# Altium project MMB_Controller.PrjPcb (part 3 of 4)

## Sheet SLO.SchDoc
size B; DrawnBy: PWS; Engineer: PWS; DocumentNumber: 6; Revision: 1; SheetNumber: 6; SheetTotal: 7
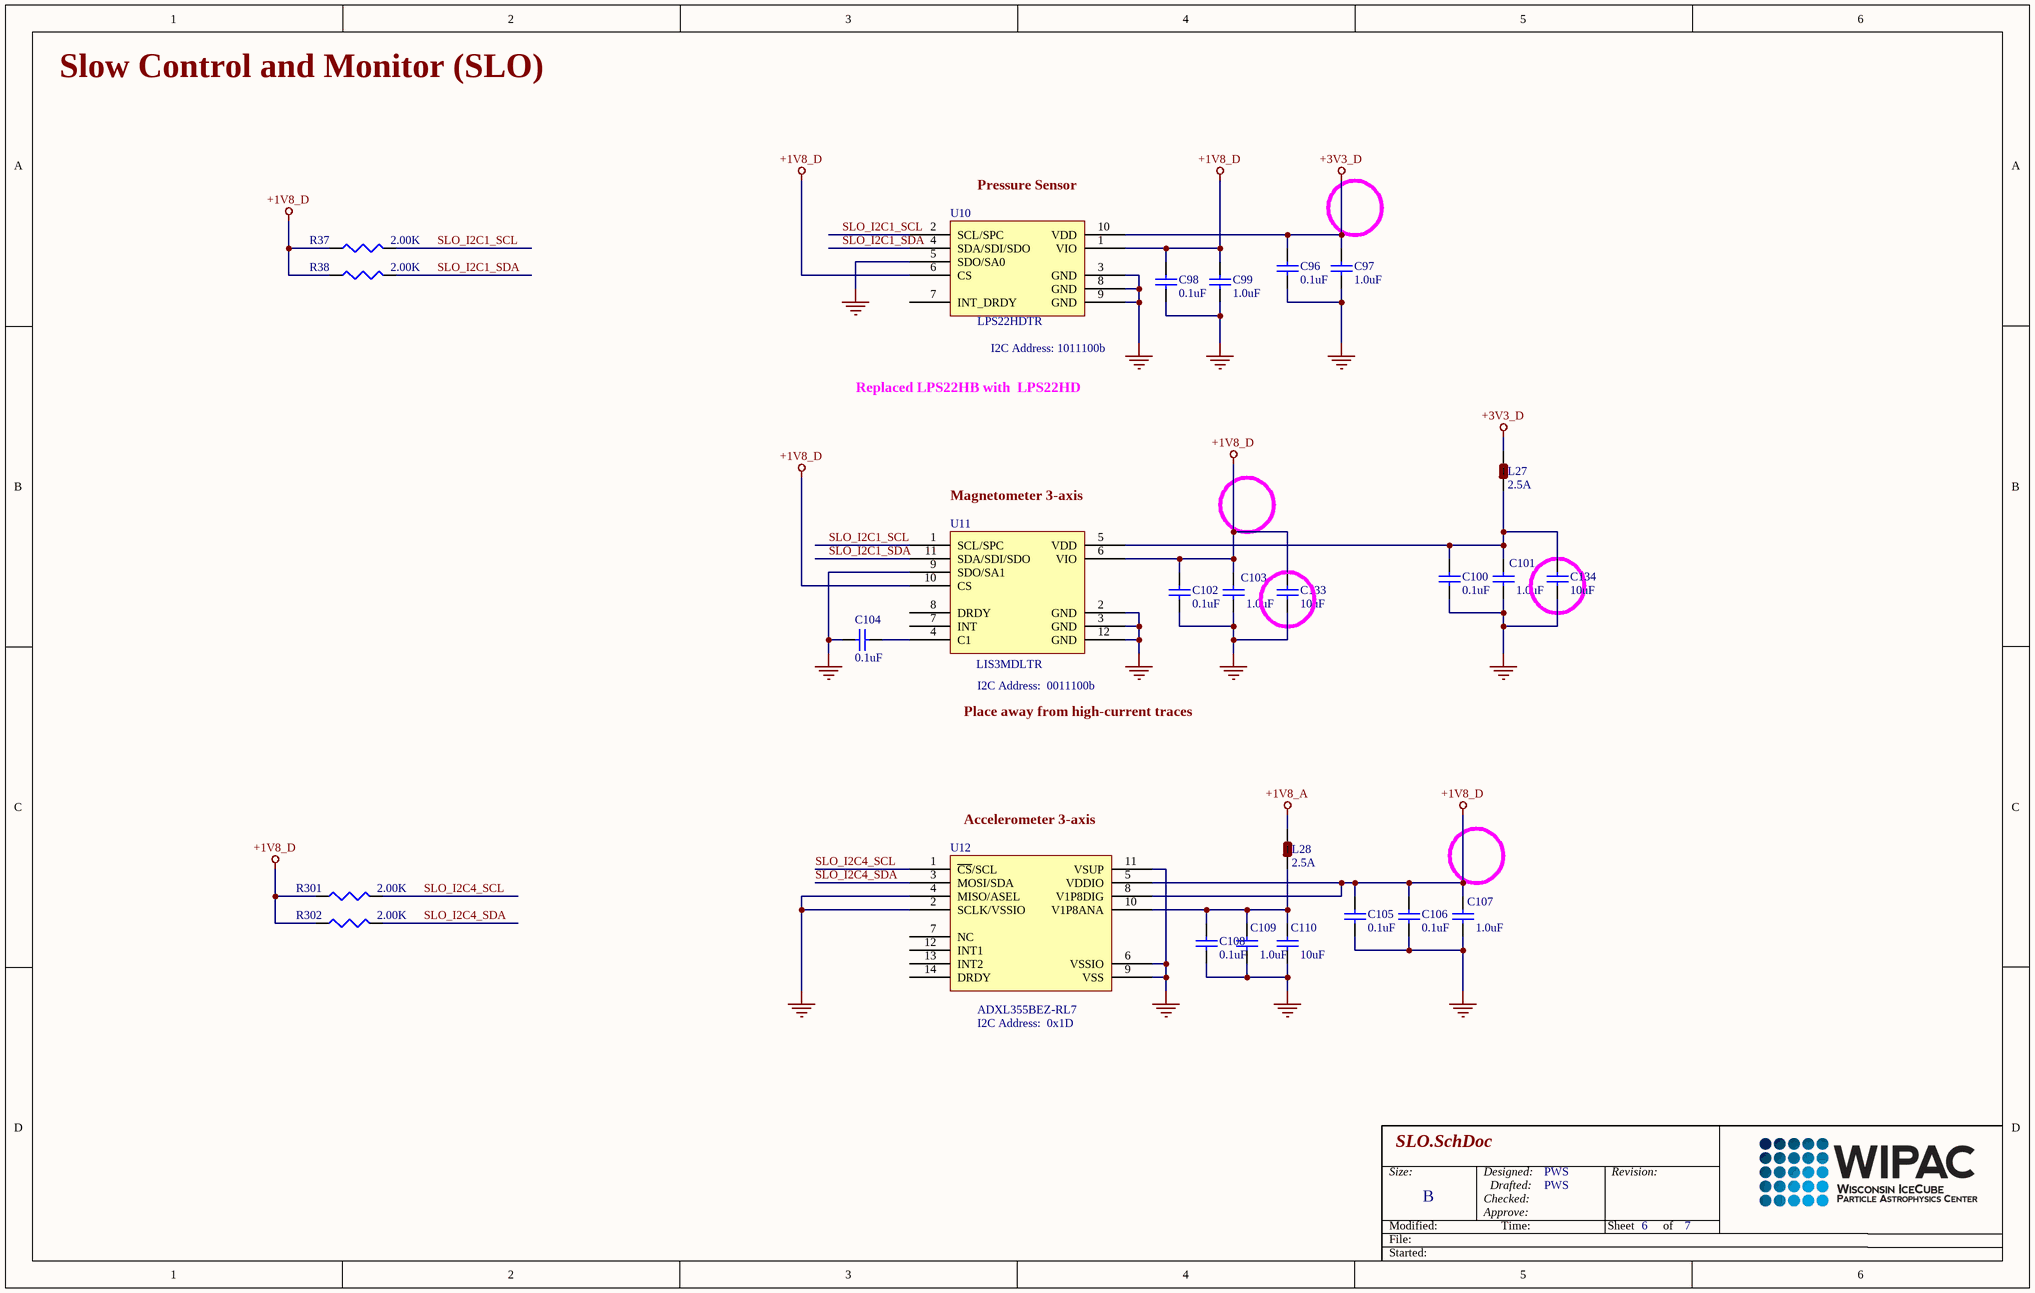
[diagram p3: SLO.SchDoc]

### Parts
C96  Capacitance: 0.1uF  [CAPC_0603]  (hidden comment: 0.1uF_603_50V)
C97  Capacitance: 1.0uF  [CAPC_0603]  (hidden comment: 1.0uF_603_25V)
C98  Capacitance: 0.1uF  [CAPC_0603]  (hidden comment: 0.1uF_603_50V)
C99  Capacitance: 1.0uF  [CAPC_0603]  (hidden comment: 1.0uF_603_25V)
C100  Capacitance: 0.1uF  [CAPC_0603]  (hidden comment: 0.1uF_603_50V)
C101  Capacitance: 1.0uF  [CAPC_0603]  (hidden comment: 1.0uF_603_25V)
C102  Capacitance: 0.1uF  [CAPC_0603]  (hidden comment: 0.1uF_603_50V)
C103  Capacitance: 1.0uF  [CAPC_0603]  (hidden comment: 1.0uF_603_25V)
C104  Capacitance: 0.1uF  [CAPC_0603]  (hidden comment: 0.1uF_603_50V)
C105  Capacitance: 0.1uF  [CAPC_0603]  (hidden comment: 0.1uF_603_50V)
C106  Capacitance: 0.1uF  [CAPC_0603]  (hidden comment: 0.1uF_603_50V)
C107  Capacitance: 1.0uF  [CAPC_0603]  (hidden comment: 1.0uF_603_25V)
C108  Capacitance: 0.1uF  [CAPC_0603]  (hidden comment: 0.1uF_603_50V)
C109  Capacitance: 1.0uF  [CAPC_0603]  (hidden comment: 1.0uF_603_25V)
C110  Capacitance: 10uF  [CAPC_0805]  (hidden comment: 10uF_805_10V)
C133  Capacitance: 10uF  [CAPC_0805]  (hidden comment: 10uF_805_10V)
C134  Capacitance: 10uF  [CAPC_0805]  (hidden comment: 10uF_805_10V)
L27  Max Current Rating: 2.5A  [SMD-0805]  (hidden comment: 2.5A_Bead_0805)
L28  Max Current Rating: 2.5A  [SMD-0805]  (hidden comment: 2.5A_Bead_0805)
R37  Resistance: 2.00K  [RES_0603]  (hidden comment: R_2.00K_603_1%)
R38  Resistance: 2.00K  [RES_0603]  (hidden comment: R_2.00K_603_1%)
R301  Resistance: 2.00K  [RES_0603]  (hidden comment: R_2.00K_603_1%)
R302  Resistance: 2.00K  [RES_0603]  (hidden comment: R_2.00K_603_1%)
U10  LPS22HDTR  [HLGA-10L]
U11  LIS3MDLTR  [VFLGA-12]
U12  ADXL355BEZ-RL7  [E-14-1]

### Nets
+1V8_A: L28.2
+1V8_D: C98.2 C99.2 C102.2 C103.2 C105.2 C106.2 C107.2 C133.2 R37.1 R38.1 R301.1 R302.1 U10.1(VIO) U10.6(CS) U11.6(VIO) U11.10(CS) U12.5(VDDIO) U12.8(V1P8DIG)
+3V3_D: C96.2 C97.2 L27.2 U10.10(VDD)
GND: C96.1 C97.1 C98.1 C99.1 C100.1 C101.1 C102.1 C103.1 C104.2 C105.1 C106.1 C107.1 C108.1 C109.1 C110.1 C133.1 C134.1 U10.3(GND) U10.5(SDO/SA0) U10.8(GND) U10.9(GND) U11.2(GND) U11.3(GND) U11.9(SDO/SA1) U11.12(GND) U12.2(SCLK/VSSIO) U12.4(MISO/ASEL) U12.6(VSSIO) U12.9(VSS) U12.11(VSUP)
SLO_I2C1_SCL: R37.2 U10.2(SCL/SPC) U11.1(SCL/SPC)
SLO_I2C1_SDA: R38.2 U10.4(SDA/SDI/SDO) U11.11(SDA/SDI/SDO)
SLO_I2C4_SCL: R301.2 U12.1(~{CS}/SCL)
SLO_I2C4_SDA: R302.2 U12.3(MOSI/SDA)
NetC100_2: C100.2 C101.2 C134.2 L27.1 U11.5(VDD)
NetC104_1: C104.1 U11.4(C1)
NetC108_2: C108.2 C109.2 C110.2 L28.1 U12.10(V1P8ANA)

Not connected (* = marked no-connect by the designer): U10 7(INT_DRDY); U11 7(INT) 8(DRDY); U12 7(NC) 12(INT1) 13(INT2) 14(DRDY)

### Notes on the sheet
- Slow Control and Monitor (SLO)
- (near U10) Pressure Sensor
- (near U10) I2C Address: 1011100b
- Replaced LPS22HB with  LPS22HD
- (near U11) Magnetometer 3-axis
- (near U11) I2C Address:  0011100b
- Place away from high-current traces
- (near U12) Accelerometer 3-axis
- (near U12) I2C Address:  0x1D
- Size:
- Designed:
- Revision:
- Modified:
- File:
- B
- Checked:
- Approve:
- Drafted:
- Time:
- Sheet
- of
- Started:

### Library data of the parts
C96 C98 C100 C102 C104-C106 C108 = CapC_0.1uF_603_50V: 0.1µF ±10% 50V Ceramic Capacitor X7R 0603 (1608 Metric); Manufacturer: TDK; Manufacturer Part Number: CGJ3E2X7R1H104K080AA; Ratings: COTS; ComponentLink1Description: Datasheet; ComponentLink1URL: https://product.tdk.com/info/en/catalog/datasheets/mlcc_highreliability_general_en.pdf; ComponentLink2Description: Supplier Link; ComponentLink2URL: https://www.digikey.com/products/en?keywords=445-8122-1-ND; Supplier 1: Digi-Key; Stock 1: 697211; Pricing 1: 1 = 0.22000, 10 = 0.15300, 100 = 0.07740, 500 = 0.05294, 1000 = 0.04683 (USD); RoHS: Yes; Mount: Surface Mount; Case/Package: 0603; Weight: 7.1E-05oz; Case Code (Imperial): 0603; Case Code (Metric): 1608; Min Operating Temperature: -55°C; Max Operating Temperature: 125°C; Tolerance: 10%; Voltage Rating: 50V; Voltage Rating (DC): 50V; Packaging: Tape and Reel; Package Quantity: 1; Dielectric: X7R; Termination: SMD/SMT; Composition: Ceramic; Length: 1.6mm; Height: 0.8mm; Width: 0.8mm; Thickness: 0.035inch; Depth: 0.8mm; Radiation Hardening: No; Lead Free: Lead Free; Supplier Part Number 1: 445-8122-1-ND
C97 C99 C101 C103 C107 C109 = CapC_1.0uF_603_25V: 1µF ±10% 25V Ceramic Capacitor X7R 0603 (1608 Metric); Manufacturer: Murata; Manufacturer Part Number: GCJ188R71E105KA01D; Supplier 1: Digi-Key; Supplier Part Number 1: 490-14409-1-ND; RoHS: No; ComponentLink1URL: https://www.digikey.com/products/en?keywords=490-14409-1-ND; ComponentLink1Description: Supplier Link; Stock 1: 166271; Pricing 1: 1=0.28000, 10=0.19400, 100=0.11020, 500=0.07780, 1000=0.06807 (USD); Case/Package: 0603; Lead Free: Lead Free; ComponentLink2Description: Datasheet; ComponentLink2URL: https://search.murata.co.jp/Ceramy/image/img/A01X/G101/ENG/GCJ188R71E105KA01-01.pdf; ComponentLink3Description: Catalog; ComponentLink3URL: https://www.murata.com/~/media/webrenewal/support/library/catalog/products/capacitor/mlcc/c03e.ashx?la=en-us
C110 C133 C134 = CapC_10uF_805_10V: Capacitor; Manufacturer: Murata; Manufacturer Part Number: GCJ21BR71A106KE01L; Tolerance: 10%; Dielectric: X7R; Voltage Rating: 10V; ComponentLink1URL: https://www.murata.com/~/media/webrenewal/support/library/catalog/products/capacitor/mlcc/c03e.ashx?la=en-us; ComponentLink1Description: Datasheet; Supplier 1: Digi-Key; Stock 1: 140399; Pricing 1: 1 = 0.70000, 10 = 0.49300, 100 = 0.32440, 500 = 0.24032, 1000 = 0.20428 (USD); RoHS: Yes; ComponentLink2URL: https://www.digikey.com/products/en?keywords=490-12646-1-ND; ComponentLink2Description: Supplier Link; Supplier Part Number 1: 490-12646-1-ND; Mount: Surface Mount; Case/Package: 0805; Weight: 0.000335oz; Case Code (Metric): 2012; Case Code (Imperial): 0805; Min Operating Temperature: -55°C; Max Operating Temperature: 125°C; Packaging: Tape and Reel; Termination: SMD/SMT; Voltage Rating (DC): 10V; Package Quantity: 3000; Features: Soft Termination; Length: 2mm; Height: 1.25mm; Width: 0.049inch; Thickness: 0.057inch; Depth: 1.25mm; Ratings: AEC-Q200
L27 L28 = Bead SM_805_2.5A_TDK: MPZ2012S331ATD25; Manufacturer: TDK; DC Resistance (DCR): 50mR; Number of Lines: 1; Impedance: 330R; Tolerance: 25%; Test Frequency: 100MHz; Supplier 1: Digi-Key; Manufacturer Part Number: MPZ2012S331ATD25; RoHS: Yes; Stock 1: 19319; Pricing 1: 1=0.13000, 10=0.10400, 25=0.08080, 50=0.06700, 100=0.05780, 250=0.04620, 500=0.04158, 1000=0.03465 (USD); Packaging: Tape and Reel; ComponentLink1URL: https://product.tdk.com/info/en/catalog/datasheets/beads_automotive_power_mpz2012_en.pdf; ComponentLink1Description: Datasheet; Supplier Part Number 1: 445-172907-1-ND; Mount: Surface Mount; Case/Package: 0805; Weight: 0.000194oz; Case Code (Metric): 2012; Case Code (Imperial): 0805; Min Operating Temperature: -55°C; Max Operating Temperature: 125°C; Package Quantity: 4000; Termination: SMD/SMT; Max DC Current: 2.5A; Length: 0.079inch; Height: 0.041inch; Width: 0.049inch; Ratings: AEC-Q200; Lead Free: Lead Free
R37 R38 R301 R302 = R_2.00K_603_1%: RES 2.00K OHM 1/10W 1% 0603 SMD; Manufacturer: Panasonic; Manufacturer Part Number: ERJ3EKF2001V; Temperature Coefficient: 100ppm/°C; Max Power Dissipation: 100mW; Voltage Rating: 75V; Voltage Rating (DC): 50V; Supplier 1: Digi-Key; RoHS: Yes; Stock 1: 3931284; Pricing 1: 1 = 0.10000, 10 = 0.06500, 100 = 0.02640, 1000 = 0.01186, 2500 = 0.01029 (USD); Packaging: Tape and Reel; Tolerance: 1%; Composition: Thick Film; Features: Automotive AEC-Q200; Height: 0.022inch; Number of Terminations: 2; ComponentLink1URL: https://datasheet.ciiva.com/16200/aoa0000ce2-16200501.pdf?src-supplier=Future+Electronics; ComponentLink1Description: https://datasheet.ciiva.com/16200/aoa0000ce2-16200501.pdf?src-supplier=Future+Electronics; Supplier Part Number 1: P2.00KHCT-ND; Mount: Surface Mount; Case/Package: 0603; Contact Plating: Tin; Case Code (Metric): 1608; Case Code (Imperial): 0603; Min Operating Temperature: -55°C; Max Operating Temperature: 155°C; Package Quantity: 1; Power Rating: 100mW; Military Standard: Not; Termination: SMD/SMT; Length: 1.6mm; Width: 0.031inch; Depth: 0.8mm; Radiation Hardening: No; REACH SVHC: No SVHC; Lead Free: Lead Free; ComponentLink2URL: https://datasheet.ciiva.com/43460/1678782-43460485.pdf?src-supplier=Farnell; ComponentLink2Description: https://datasheet.ciiva.com/43460/1678782-43460485.pdf?src-supplier=Farnell; ComponentLink3URL: https://datasheet.ciiva.com/28673/1678782-28673990.pdf?src-supplier=Element14; ComponentLink3Description: https://datasheet.ciiva.com/28673/1678782-28673990.pdf?src-supplier=Element14; ComponentLink4URL: https://datasheet.ciiva.com/46377/1678782-46377366.pdf?src-supplier=Element14; ComponentLink4Description: https://datasheet.ciiva.com/46377/1678782-46377366.pdf?src-supplier=Element14; ComponentLink5URL: https://datasheet.ciiva.com/30064/aoa0000ce2-30064920.pdf?src-supplier=Onlinecomponents.com; ComponentLink5Description: https://datasheet.ciiva.com/30064/aoa0000ce2-30064920.pdf?src-supplier=Onlinecomponents.com; ComponentLink6URL: https://datasheet.ciiva.com/16771/70260748-16771369.pdf?src-supplier=Allied+Electronics; ComponentLink6Description: https://datasheet.ciiva.com/16771/70260748-16771369.pdf?src-supplier=Allied+Electronics; ComponentLink7URL: https://datasheet.ciiva.com/17214/aoa0000ce2-17214393.pdf?src-supplier=Avnet+Europe; ComponentLink7Description: https://datasheet.ciiva.com/17214/aoa0000ce2-17214393.pdf?src-supplier=Avnet+Europe; ComponentLink8URL: https://datasheet.ciiva.com/6082/1678782-6082059.pdf?src-supplier=Farnell; ComponentLink8Description: https://datasheet.ciiva.com/6082/1678782-6082059.pdf?src-supplier=Farnell; ComponentLink9URL: https://datasheet.ciiva.com/24027/aoa0000ce2-24027453.pdf?src-supplier=Mouser; ComponentLink9Description: https://datasheet.ciiva.com/24027/aoa0000ce2-24027453.pdf?src-supplier=Mouser
U10 = LPS22HDTR: Pressure Sensor  Absolute   10-VFLGA; Manufacturer: STMicroelectronics; Supplier 1: Digi-Key; Manufacturer Part Number: LPS22HDTR; Stock 1: 178; Pricing 1: 1 = 4.23000, 10 = 3.79600, 25 = 3.58880, 100 = 3.11030, 500 = 2.64770, 1000 = 2.23300 (USD); RoHS: No; ComponentLink2URL: https://www.digikey.com/products/en?keywords=497-17587-1-ND; ComponentLink2Description: Supplier Link; Supplier Part Number 1: 497-17587-1-ND; ComponentLink1Description: Datasheet; ComponentLink1URL: https://www.st.com/content/ccc/resource/technical/document/datasheet/group3/8a/d9/56/bc/42/4c/42/ae/DM00342209/files/DM00342209.pdf/jcr:content/translations/en.DM00342209.pdf; ComponentLink3URL: http://www.st.com/content/ccc/resource/technical/document/datasheet/group3/8a/d9/56/bc/42/4c/42/ae/DM00342209/files/DM00342209.pdf/jcr:content/translations/en.DM00342209.pdf?src-supplier=Digi-Key; ComponentLink3Description: http://www.st.com/content/ccc/resource/technical/document/datasheet/group3/8a/d9/56/bc/42/4c/42/ae/DM00342209/files/DM00342209.pdf/jcr:content/translations/en.DM00342209.pdf?src-supplier=Digi-Key
U11 = LIS3MDLTR: Magnetoresistive Sensor X, Y, Z Axis 12-LGA (2x2); Manufacturer: STMicroelectronics; Max Supply Voltage: 3.6V; Min Supply Voltage: 1.9V; Max Supply Current: 270uA; Resolution: 16b; Output Type: SPI; Axis: X, Y, Z; ComponentLink1Description: Datasheet; ComponentLink1URL: https://www.st.com/content/ccc/resource/technical/document/datasheet/54/2a/85/76/e3/97/42/18/DM00075867.pdf/files/DM00075867.pdf/jcr:content/translations/en.DM00075867.pdf; Supplier 1: Digi-Key; Manufacturer Part Number: LIS3MDLTR; Stock 1: 20171; Pricing 1: 1 = 1.67000, 10 = 1.49800, 100 = 1.20450, 500 = 0.98958, 1000 = 0.81993 (USD); RoHS: Yes; Mount: Surface Mount; Case/Package: LGA; Number of Pins: 12; Contact Plating: Gold; Min Operating Temperature: -40°C; Max Operating Temperature: 85°C; Packaging: Tape and Reel; Package Quantity: 8000; Sensing Method: Magnetoresistive; Radiation Hardening: No; REACH SVHC: No SVHC; Lead Free: Lead Free; Supplier Part Number 1: 497-13892-1-ND; ComponentLink2Description: Footprint data; ComponentLink2URL: http://mydiscuz.b0.upaiyun.com/forum/201602/17/145811me52roaer17ott71.attach?_upd=LSM303AGR_Footprint.pdf
U12 = ADXL355BEZ-RL7: Accelerometer X, Y, Z Axis ±2g, 4g, 8g 1.5kHz 14-CLCC (6x6); Manufacturer: Analog Devices; ComponentLink1Description: Datasheet; ComponentLink1URL: https://www.analog.com/media/en/technical-documentation/data-sheets/ADXL354_355.pdf; Supplier 1: Digi-Key; Manufacturer Part Number: ADXL355BEZ-RL7; Stock 1: 1191; Pricing 1: 1 = 53.40000, 10 = 50.16300, 100 = 44.98520 (USD); RoHS: No; Number of Pins: 14; Lead Free: Contains Lead; ComponentLink2URL: https://www.analog.com/media/en/technical-documentation/data-sheets/ADXL354_355.pdf?src-supplier=Digi-Key; ComponentLink2Description: https://www.analog.com/media/en/technical-documentation/data-sheets/ADXL354_355.pdf?src-supplier=Digi-Key; Supplier Part Number 1: ADXL355BEZ-RL7CT-ND

## Sheet XTIO.SchDoc
size B; DrawnBy: PWS; Engineer: PWS; Organization: WIPAC; Revision: 2.0; SheetNumber: 7; SheetTotal: 7; DocumentNumber: 7
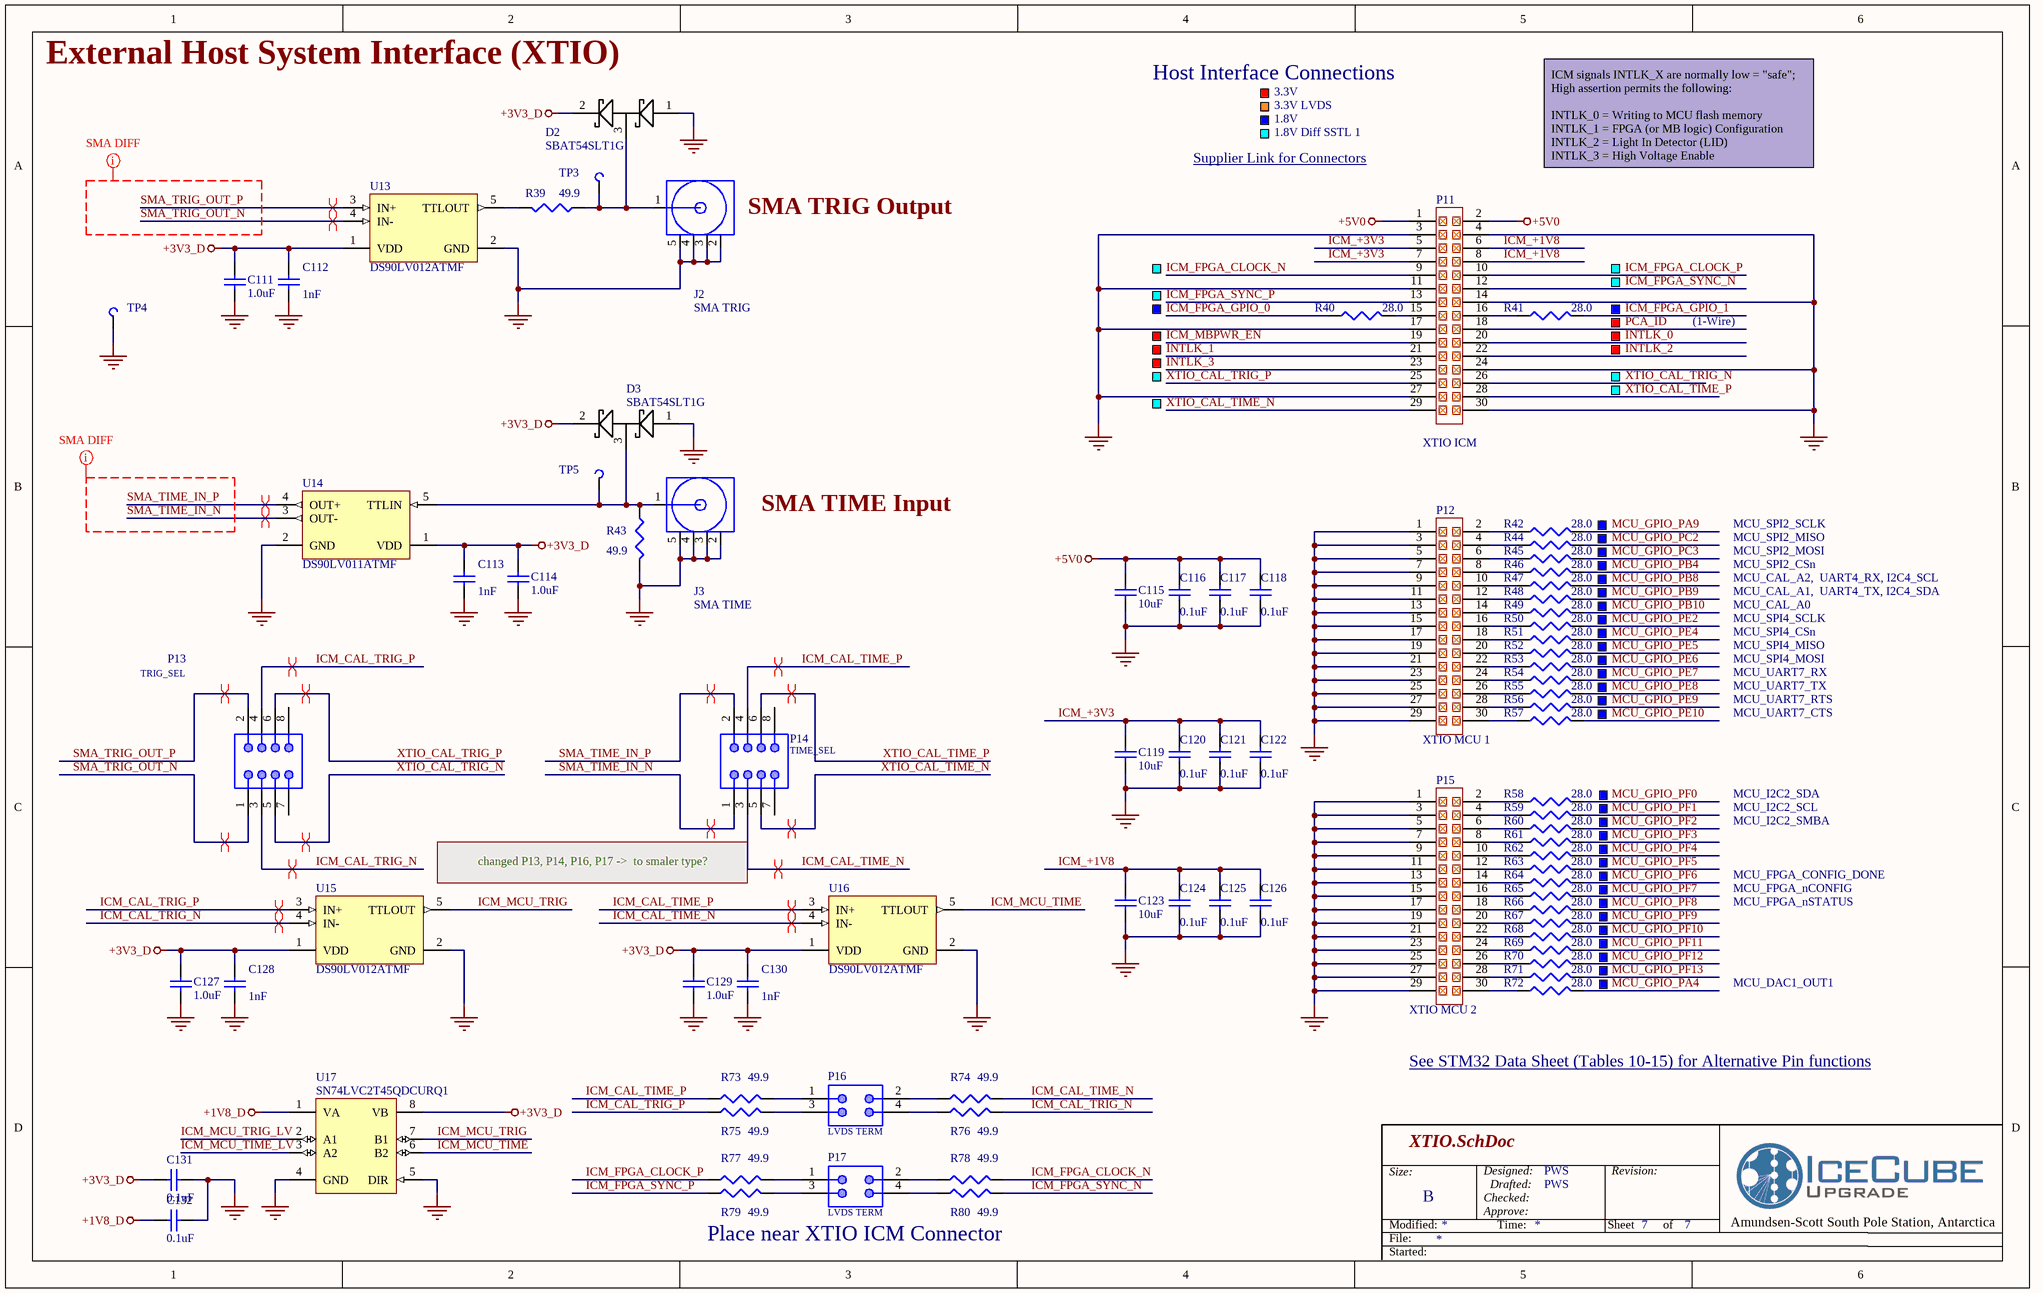
[diagram p4: XTIO.SchDoc]

### Parts
C111  Capacitance: 1.0uF  [CAPC_0603]  (hidden comment: 1.0uF_603_25V)
C112  Capacitance: 1nF  [CAPC_0603]  (hidden comment: 1000pF_603_50V)
C113  Capacitance: 1nF  [CAPC_0603]  (hidden comment: 1000pF_603_50V)
C114  Capacitance: 1.0uF  [CAPC_0603]  (hidden comment: 1.0uF_603_25V)
C115  Capacitance: 10uF  [CAPC_0805]  (hidden comment: 10uF_805_10V)
C116  Capacitance: 0.1uF  [CAPC_0603]  (hidden comment: 0.1uF_603_50V)
C117  Capacitance: 0.1uF  [CAPC_0603]  (hidden comment: 0.1uF_603_50V)
C118  Capacitance: 0.1uF  [CAPC_0603]  (hidden comment: 0.1uF_603_50V)
C119  Capacitance: 10uF  [CAPC_0805]  (hidden comment: 10uF_805_10V)
C120  Capacitance: 0.1uF  [CAPC_0603]  (hidden comment: 0.1uF_603_50V)
C121  Capacitance: 0.1uF  [CAPC_0603]  (hidden comment: 0.1uF_603_50V)
C122  Capacitance: 0.1uF  [CAPC_0603]  (hidden comment: 0.1uF_603_50V)
C123  Capacitance: 10uF  [CAPC_0805]  (hidden comment: 10uF_805_10V)
C124  Capacitance: 0.1uF  [CAPC_0603]  (hidden comment: 0.1uF_603_50V)
C125  Capacitance: 0.1uF  [CAPC_0603]  (hidden comment: 0.1uF_603_50V)
C126  Capacitance: 0.1uF  [CAPC_0603]  (hidden comment: 0.1uF_603_50V)
C127  Capacitance: 1.0uF  [CAPC_0603]  (hidden comment: 1.0uF_603_25V)
C128  Capacitance: 1nF  [CAPC_0603]  (hidden comment: 1000pF_603_50V)
C129  Capacitance: 1.0uF  [CAPC_0603]  (hidden comment: 1.0uF_603_25V)
C130  Capacitance: 1nF  [CAPC_0603]  (hidden comment: 1000pF_603_50V)
C131  Capacitance: 0.1uF  [CAPC_0603]  (hidden comment: 0.1uF_603_50V)
C132  Capacitance: 0.1uF  [CAPC_0603]  (hidden comment: 0.1uF_603_50V)
D2  SBAT54SLT1G  [SOT-23]
D3  SBAT54SLT1G  [SOT-23]
J2  SMA TRIG  [SMA Vertical 200LS]
J3  SMA TIME  [SMA Vertical 200LS]
P11  XTIO ICM  [45230-220230]
P12  XTIO MCU 1  [45230-220230]
P13  TRIG_SEL  [62100821021]
P14  TIME_SEL  [62100821021]
P15  XTIO MCU 2  [45230-220230]
P16  LVDS TERM  [62100421021]
P17  LVDS TERM  [62100421021]
R39  Resistance: 49.9  [RES_1206]  (hidden comment: R_49.9_1206_1%)
R40  Resistance: 28.0  [RES_0603]  (hidden comment: R_28.0_603_1%)
R41  Resistance: 28.0  [RES_0603]  (hidden comment: R_28.0_603_1%)
R42  Resistance: 28.0  [RES_0603]  (hidden comment: R_28.0_603_1%)
R43  Resistance: 49.9  [RES_1206]  (hidden comment: R_49.9_1206_1%)
R44  Resistance: 28.0  [RES_0603]  (hidden comment: R_28.0_603_1%)
R45  Resistance: 28.0  [RES_0603]  (hidden comment: R_28.0_603_1%)
R46  Resistance: 28.0  [RES_0603]  (hidden comment: R_28.0_603_1%)
R47  Resistance: 28.0  [RES_0603]  (hidden comment: R_28.0_603_1%)
R48  Resistance: 28.0  [RES_0603]  (hidden comment: R_28.0_603_1%)
R49  Resistance: 28.0  [RES_0603]  (hidden comment: R_28.0_603_1%)
R50  Resistance: 28.0  [RES_0603]  (hidden comment: R_28.0_603_1%)
R51  Resistance: 28.0  [RES_0603]  (hidden comment: R_28.0_603_1%)
R52  Resistance: 28.0  [RES_0603]  (hidden comment: R_28.0_603_1%)
R53  Resistance: 28.0  [RES_0603]  (hidden comment: R_28.0_603_1%)
R54  Resistance: 28.0  [RES_0603]  (hidden comment: R_28.0_603_1%)
R55  Resistance: 28.0  [RES_0603]  (hidden comment: R_28.0_603_1%)
R56  Resistance: 28.0  [RES_0603]  (hidden comment: R_28.0_603_1%)
R57  Resistance: 28.0  [RES_0603]  (hidden comment: R_28.0_603_1%)
R58  Resistance: 28.0  [RES_0603]  (hidden comment: R_28.0_603_1%)
R59  Resistance: 28.0  [RES_0603]  (hidden comment: R_28.0_603_1%)
R60  Resistance: 28.0  [RES_0603]  (hidden comment: R_28.0_603_1%)
R61  Resistance: 28.0  [RES_0603]  (hidden comment: R_28.0_603_1%)
R62  Resistance: 28.0  [RES_0603]  (hidden comment: R_28.0_603_1%)
R63  Resistance: 28.0  [RES_0603]  (hidden comment: R_28.0_603_1%)
R64  Resistance: 28.0  [RES_0603]  (hidden comment: R_28.0_603_1%)
R65  Resistance: 28.0  [RES_0603]  (hidden comment: R_28.0_603_1%)
R66  Resistance: 28.0  [RES_0603]  (hidden comment: R_28.0_603_1%)
R67  Resistance: 28.0  [RES_0603]  (hidden comment: R_28.0_603_1%)
R68  Resistance: 28.0  [RES_0603]  (hidden comment: R_28.0_603_1%)
R69  Resistance: 28.0  [RES_0603]  (hidden comment: R_28.0_603_1%)
R70  Resistance: 28.0  [RES_0603]  (hidden comment: R_28.0_603_1%)
R71  Resistance: 28.0  [RES_0603]  (hidden comment: R_28.0_603_1%)
R72  Resistance: 28.0  [RES_0603]  (hidden comment: R_28.0_603_1%)
R73  Resistance: 49.9  [RES_0603]  (hidden comment: R_49.9_603_1%)
R74  Resistance: 49.9  [RES_0603]  (hidden comment: R_49.9_603_1%)
R75  Resistance: 49.9  [RES_0603]  (hidden comment: R_49.9_603_1%)
R76  Resistance: 49.9  [RES_0603]  (hidden comment: R_49.9_603_1%)
R77  Resistance: 49.9  [RES_0603]  (hidden comment: R_49.9_603_1%)
R78  Resistance: 49.9  [RES_0603]  (hidden comment: R_49.9_603_1%)
R79  Resistance: 49.9  [RES_0603]  (hidden comment: R_49.9_603_1%)
R80  Resistance: 49.9  [RES_0603]  (hidden comment: R_49.9_603_1%)
TP3  PC TEST POINT MINI SMD  [Test Point SM]  (value not drawn)
TP4  PC TEST POINT MINI SMD  [Test Point SM]  (value not drawn)
TP5  PC TEST POINT MINI SMD  [Test Point SM]  (value not drawn)
U13  DS90LV012ATMF  [MF05A_N]
U14  DS90LV011ATMF  [MF05A_N]
U15  DS90LV012ATMF  [MF05A_N]
U16  DS90LV012ATMF  [MF05A_N]
U17  SN74LVC2T45QDCURQ1  [TI-DGK8_N]

### Nets
+1V8_D: C132.2 U17.1(VA)
+3V3_D: C111.2 C112.2 C113.2 C114.2 C127.2 C128.2 C129.2 C130.2 C131.2 D2.2 D3.2 U13.1(VDD) U14.1(VDD) U15.1(VDD) U16.1(VDD) U17.8(VB)
+5V0: C115.2 C116.2 C117.2 C118.2 P11.1 P11.2
GND: C111.1 C112.1 C113.1 C114.1 C115.1 C116.1 C117.1 C118.1 C119.1 C120.1 C121.1 C122.1 C123.1 C124.1 C125.1 C126.1 C127.1 C128.1 C129.1 C130.1 C131.1 C132.1 D2.1 D3.1 J2.2(GND) J2.3(GND) J2.4(GND) J2.5(GND) J3.2(GND) J3.3(GND) J3.4(GND) J3.5(GND) P11.3 P11.4 P11.11 P11.14 P11.17 P11.24 P11.27 P11.30 P12.1 P12.3 P12.5 P12.7 P12.9 P12.11 P12.13 P12.15 P12.17 P12.19 P12.21 P12.23 P12.25 P12.27 P12.29 P15.1 P15.3 P15.5 P15.7 P15.9 P15.11 P15.13 P15.15 P15.17 P15.19 P15.21 P15.23 P15.25 P15.27 P15.29 R43.1 TP4.1 U13.2(GND) U14.2(GND) U15.2(GND) U16.2(GND) U17.4(GND) U17.5(DIR)
ICM_+1V8: C123.2 C124.2 C125.2 C126.2 P11.6 P11.8
ICM_+3V3: C119.2 C120.2 C121.2 C122.2 P11.5 P11.7
ICM_CAL_TIME_N: P14.3 R74.2 U16.4(IN-)
ICM_CAL_TIME_P: P14.4 R73.1 U16.3(IN+)
ICM_CAL_TRIG_N: P13.3 R76.2 U15.4(IN-)
ICM_CAL_TRIG_P: P13.4 R75.1 U15.3(IN+)
ICM_FPGA_CLOCK_N: P11.9 R78.2
ICM_FPGA_CLOCK_P: P11.10 R77.1
ICM_FPGA_GPIO_0: R40.1
ICM_FPGA_GPIO_1: R41.2
ICM_FPGA_SYNC_N: P11.12 R80.2
ICM_FPGA_SYNC_P: P11.13 R79.1
ICM_MBPWR_EN: P11.19
ICM_MCU_TIME: U16.5(TTLOUT) U17.6(B2)
ICM_MCU_TIME_LV: U17.3(A2)
ICM_MCU_TRIG: U15.5(TTLOUT) U17.7(B1)
ICM_MCU_TRIG_LV: U17.2(A1)
INTLK_0: P11.20
INTLK_1: P11.21
INTLK_2: P11.22
INTLK_3: P11.23
MCU_GPIO_PA4: R72.2
MCU_GPIO_PA9: R42.2
MCU_GPIO_PB4: R46.2
MCU_GPIO_PB8: R47.2
MCU_GPIO_PB9: R48.2
MCU_GPIO_PB10: R49.2
MCU_GPIO_PC2: R44.2
MCU_GPIO_PC3: R45.2
MCU_GPIO_PE2: R50.2
MCU_GPIO_PE4: R51.2
MCU_GPIO_PE5: R52.2
MCU_GPIO_PE6: R53.2
MCU_GPIO_PE7: R54.2
MCU_GPIO_PE8: R55.2
MCU_GPIO_PE9: R56.2
MCU_GPIO_PE10: R57.2
MCU_GPIO_PF0: R58.2
MCU_GPIO_PF1: R59.2
MCU_GPIO_PF2: R60.2
MCU_GPIO_PF3: R61.2
MCU_GPIO_PF4: R62.2
MCU_GPIO_PF5: R63.2
MCU_GPIO_PF6: R64.2
MCU_GPIO_PF7: R65.2
MCU_GPIO_PF8: R66.2
MCU_GPIO_PF9: R67.2
MCU_GPIO_PF10: R68.2
MCU_GPIO_PF11: R69.2
MCU_GPIO_PF12: R70.2
MCU_GPIO_PF13: R71.2
PCA_ID: P11.18
SMA_TIME_IN_N: P14.1 U14.3(OUT-)
SMA_TIME_IN_P: P14.2 U14.4(OUT+)
SMA_TRIG_OUT_N: P13.1 U13.4(IN-)
SMA_TRIG_OUT_P: P13.2 U13.3(IN+)
XTIO_CAL_TIME_N: P11.29 P14.5
XTIO_CAL_TIME_P: P11.28 P14.6
XTIO_CAL_TRIG_N: P11.26 P13.5
XTIO_CAL_TRIG_P: P11.25 P13.6
NetD2_3: D2.3 J2.1(Signal) R39.1 TP3.1
NetD3_3: D3.3 J3.1(Signal) R43.2 TP5.1 U14.5(TTLIN)
NetP11_15: P11.15 R40.2
NetP11_16: P11.16 R41.1
NetP12_2: P12.2 R42.1
NetP12_4: P12.4 R44.1
NetP12_6: P12.6 R45.1
NetP12_8: P12.8 R46.1
NetP12_10: P12.10 R47.1
NetP12_12: P12.12 R48.1
NetP12_14: P12.14 R49.1
NetP12_16: P12.16 R50.1
NetP12_18: P12.18 R51.1
NetP12_20: P12.20 R52.1
NetP12_22: P12.22 R53.1
NetP12_24: P12.24 R54.1
NetP12_26: P12.26 R55.1
NetP12_28: P12.28 R56.1
NetP12_30: P12.30 R57.1
NetP15_2: P15.2 R58.1
NetP15_4: P15.4 R59.1
NetP15_6: P15.6 R60.1
NetP15_8: P15.8 R61.1
NetP15_10: P15.10 R62.1
NetP15_12: P15.12 R63.1
NetP15_14: P15.14 R64.1
NetP15_16: P15.16 R65.1
NetP15_18: P15.18 R66.1
NetP15_20: P15.20 R67.1
NetP15_22: P15.22 R68.1
NetP15_24: P15.24 R69.1
NetP15_26: P15.26 R70.1
NetP15_28: P15.28 R71.1
NetP15_30: P15.30 R72.1
NetP16_1: P16.1 R73.2
NetP16_2: P16.2 R74.1
NetP16_3: P16.3 R75.2
NetP16_4: P16.4 R76.1
NetP17_1: P17.1 R77.2
NetP17_2: P17.2 R78.1
NetP17_3: P17.3 R79.2
NetP17_4: P17.4 R80.1
NetR39_2: R39.2 U13.5(TTLOUT)

Not connected (* = marked no-connect by the designer): P13 7 8; P14 7 8

### Layout directives
differential pair: ICM_CAL_TIME_N, ICM_CAL_TIME_P, ICM_CAL_TRIG_N, ICM_CAL_TRIG_P, SMA_TIME_IN_N, SMA_TIME_IN_P, SMA_TRIG_OUT_N, SMA_TRIG_OUT_P, XTIO_CAL_TIME_N, XTIO_CAL_TIME_P, XTIO_CAL_TRIG_N, XTIO_CAL_TRIG_P
net class SMA DIFF: SMA_TIME_IN_N, SMA_TIME_IN_P, SMA_TRIG_OUT_N, SMA_TRIG_OUT_P

### Notes on the sheet
- (near D2) External Host System Interface (XTIO)
- Host Interface Connections
- 3.3V
- Supplier Link for Connectors
- 1.8V Diff SSTL 1
- 3.3V LVDS
- 1.8V
- ICM signals INTLK_X are normally low = "safe";
  High assertion permits the following:
  INTLK_0 = Writing to MCU flash memory
  INTLK_1 = FPGA (or MB logic) Configuration
  INTLK_2 = Light In Detector (LID)
  INTLK_3 = High Voltage Enable
- (near J2) SMA TRIG Output
- (1-Wire)
- (near J3) SMA TIME Input
- MCU_SPI2_CSn
- MCU_SPI2_MOSI
- MCU_SPI2_MISO
- MCU_SPI2_SCLK
- MCU_CAL_A2,  UART4_RX, I2C4_SCL
- MCU_CAL_A1,  UART4_TX, I2C4_SDA
- MCU_CAL_A0
- MCU_SPI4_CSn
- MCU_SPI4_SCLK
- MCU_SPI4_MOSI
- MCU_SPI4_MISO
- MCU_UART7_RX
- MCU_UART7_TX
- MCU_UART7_RTS
- MCU_UART7_CTS
- MCU_I2C2_SDA
- MCU_I2C2_SCL
- MCU_I2C2_SMBA
- changed P13, P14, P16, P17 ->  to smaler type?
- MCU_FPGA_CONFIG_DONE
- MCU_FPGA_nCONFIG
- MCU_FPGA_nSTATUS
- MCU_DAC1_OUT1
- See STM32 Data Sheet (Tables 10-15) for Alternative Pin functions
- Place near XTIO ICM Connector
- Size:
- Designed:
- Revision:
- Modified:
- File:
- B
- Checked:
- Approve:
- Drafted:
- Time:
- Sheet
- of
- Amundsen-Scott South Pole Station, Antarctica
- Started:

### Library data of the parts
C111 C114 C127 C129 = CapC_1.0uF_603_25V: as C97 on sheet SLO; Supplier 1: Digi-Key; Supplier Part Number 1: 490-14409-1-ND; RoHS: No; ComponentLink1URL: https://www.digikey.com/products/en?keywords=490-14409-1-ND; ComponentLink1Description: Supplier Link; Stock 1: 166271; Pricing 1: 1=0.28000, 10=0.19400, 100=0.11020, 500=0.07780, 1000=0.06807 (USD); Case/Package: 0603; Lead Free: Lead Free; ComponentLink2Description: Datasheet; ComponentLink2URL: https://search.murata.co.jp/Ceramy/image/img/A01X/G101/ENG/GCJ188R71E105KA01-01.pdf; ComponentLink3Description: Catalog; ComponentLink3URL: https://www.murata.com/~/media/webrenewal/support/library/catalog/products/capacitor/mlcc/c03e.ashx?la=en-us
C112 C113 C128 C130 = CapC_1000pF_603_50V: Capacitor; Manufacturer: Knowles Syfer; Manufacturer Part Number: 0603Y0500102KXT; Tolerance: 10%; Voltage Rating: 50V; Dielectric: X7R; Dissipation Factor: 2.5%; Supplier 1: Digi-Key; Supplier Part Number 1: 1608-1367-1-ND; RoHS: Yes; Packaging: Tape and Reel; ComponentLink1URL: https://www.knowlescapacitors.com/getattachment/2dbfc8bc-e2b3-4b4d-afb1-43b011b9ebe0/High-Std-Voltage.aspx; ComponentLink1Description: Datasheet; Stock 1: 7150; Pricing 1: 1 = 0.540000, 10 = 0.379000, 100 = 0.249600, 500 = 0.184900, 1000 = 0.157160 (USD); Case/Package: 0603; Case Code (Imperial): 0603; Case Code (Metric): 1608; Min Operating Temperature: -55°C; Max Operating Temperature: 125°C; Package Quantity: 4000; Voltage Rating (DC): 50V; Termination: SMD/SMT; Composition: Ceramic; Length: 1.6mm; Height: 0.8mm; Width: 0.8mm; Depth: 0.8mm; ComponentLink2Description: Supplier Link; ComponentLink2URL: https://www.digikey.com/product-detail/en/knowles-syfer/0603Y0500102KXT/1608-1367-1-ND/7644469
C115 C119 C123 = CapC_10uF_805_10V: Capacitor; Manufacturer: Murata; Manufacturer Part Number: GCJ21BR71A106KE01L; Tolerance: 10%; Voltage Rating: 10V; Dielectric: X7R; Supplier 1: Digi-Key; RoHS: Yes; Packaging: Tape and Reel; Ratings: AEC-Q200; Features: Soft Termination; ComponentLink1URL: https://www.murata.com/~/media/webrenewal/support/library/catalog/products/capacitor/mlcc/c03e.ashx?la=en-us; ComponentLink1Description: Datasheet; Supplier Part Number 1: 490-12646-1-ND; ComponentLink2Description: Supplier Link; ComponentLink2URL: https://www.digikey.com/products/en?keywords=490-12646-1-ND; Stock 1: 140399; Pricing 1: 1 = 0.70000, 10 = 0.49300, 100 = 0.32440, 500 = 0.24032, 1000 = 0.20428 (USD); Mount: Surface Mount; Case/Package: 0805; Weight: 0.000335oz; Case Code (Metric): 2012; Case Code (Imperial): 0805; Min Operating Temperature: -55°C; Max Operating Temperature: 125°C; Termination: SMD/SMT; Voltage Rating (DC): 10V; Package Quantity: 3000; Length: 2mm; Height: 1.25mm; Width: 0.049inch; Thickness: 0.057inch; Depth: 1.25mm
C116-C118 C120-C122 C124-C126 = CapC_0.1uF_603_50V_GCJ: 0.1µF ±10% 50V Ceramic Capacitor X7R 0603 (1608 Metric); Manufacturer: Murata; Manufacturer Part Number: GCJ188R71H104KA12D; Supplier 1: Digi-Key; Supplier Part Number 1: 490-5798-1-ND; RoHS: Yes; Packaging: Tape and Reel; Tolerance: 10%; Ratings: AEC-Q200; ComponentLink1URL: https://psearch.en.murata.com/capacitor/product/GCJ188R71H104KA12%23.pdf; ComponentLink1Description: Datasheet; ComponentLink2Description: Supplier Link; ComponentLink2URL: https://www.digikey.com/products/en?keywords=490-5798-1-ND; Stock 1: 2321609; Pricing 1: 1=0.28000, 10=0.19200, 100=0.10890, 500=0.07686, 1000=0.06725 (USD); Mount: Surface Mount; Case/Package: 0603; Case Code (Imperial): 0603; Case Code (Metric): 1608; Min Operating Temperature: -55°C; Max Operating Temperature: 125°C; Voltage Rating: 50V; Dielectric: X7R; Termination: SMD/SMT; Voltage Rating (DC): 50V; Package Quantity: 1; Length: 1.6mm; Height: 0.8mm; Width: 0.031inch; Thickness: 0.035inch; Features: Soft Termination; Depth: 0.8mm; Radiation Hardening: No; Lead Free: Lead Free
C131 C132 = CapC_0.1uF_603_50V: as C96 on sheet SLO; ComponentLink1Description: Datasheet; ComponentLink1URL: https://product.tdk.com/info/en/catalog/datasheets/mlcc_highreliability_general_en.pdf; ComponentLink2Description: Supplier Link; ComponentLink2URL: https://www.digikey.com/products/en?keywords=445-8122-1-ND; Supplier 1: Digi-Key; Stock 1: 697211; Pricing 1: 1 = 0.22000, 10 = 0.15300, 100 = 0.07740, 500 = 0.05294, 1000 = 0.04683 (USD); RoHS: Yes; Mount: Surface Mount; Case/Package: 0603; Weight: 7.1E-05oz; Case Code (Imperial): 0603; Case Code (Metric): 1608; Min Operating Temperature: -55°C; Max Operating Temperature: 125°C; Tolerance: 10%; Voltage Rating: 50V; Voltage Rating (DC): 50V; Packaging: Tape and Reel; Package Quantity: 1; Dielectric: X7R; Termination: SMD/SMT; Composition: Ceramic; Length: 1.6mm; Height: 0.8mm; Width: 0.8mm; Thickness: 0.035inch; Depth: 0.8mm; Radiation Hardening: No; Lead Free: Lead Free; Supplier Part Number 1: 445-8122-1-ND
D2 D3 = Diode ESD Pair: DIODE ARRAY SCHOTTKY 30V SOT23-3; Manufacturer: ON Semiconductor; Average Rectified Current: 200mA; Element Configuration: Dual; Forward Voltage: 800mV; Max Reverse Leakage Current: 2uA; Max Surge Current: 600mA; Power Dissipation: 225mW; Recovery Time: 5ns; Supplier 1: Digi-Key; Supplier Part Number 1: SBAT54SLT1GOSCT-ND; Manufacturer Part Number: SBAT54SLT1G; RoHS: Yes; Packaging: Tape and Reel; ComponentLink1URL: https://www.digikey.com/products/en?keywords=SBAT54SLT1GOSCT-ND; ComponentLink1Description: Supplier Link; Case/Package: SOT-23-3; ComponentLink2Description: Datasheet; ComponentLink2URL: http://www.onsemi.com/pub/Collateral/BAT54SLT1-D.PDF; Forward Current: 200mA; Halogen Free: Halogen Free; Height: 1.01mm; Lead Free: Lead Free; Length: 3.04mm; Max Operating Temperature: 150°C; Max Repetitive Reverse Voltage (Vrrm): 30V; Max Reverse Voltage (DC): 30V; Min Operating Temperature: -55°C; Number of Pins: 3; Package Quantity: 3000; Peak Non-Repetitive Surge Current: 600mA; Peak Reverse Current: 2uA; Pricing 1: 1 = 0.35000, 10 = 0.28800, 100 = 0.19580, 500 = 0.14684, 1000 = 0.11012 (USD); Radiation Hardening: No; Reverse Recovery Time: 5ns; Stock 1: 119322; Width: 1.4mm
J2 J3 = SMA-Vertical: SMA Vertical, 0.200"LS; Manufacturer: Emerson Network Power Connectivity Johnson; Manufacturer Part Number: 142-0701-231; Connector Type: Jack, Female Socket; Contact Termination: Solder; Impedance: 50 Ohm; Frequency - Max: 18GHz; Body Material: Brass; Body Finish: Gold; Center Contact Material: Beryllium Copper; Dielectric Material: Polytetrafluoroethylene (PTFE); Voltage Rating: 335V; Supplier 1: Digi-Key; Supplier Part Number 1: J608-ND; RoHS: RoHS Compliant; Category: Connectors, Interconnects; Pricing: 1=5.46, 10=4.861, 50=3.968, 100=3.5712, 250=3.2736, 500=2.7776, 750=2.63872, 1000=2.48, 2500=2.3808 (USD); Packaging: Bulk; Connector Style: SMA; Shield Termination: Solder; Mounting Type: Through Hole; Cable Group: -; Fastening Type: Threaded; Features: -; Housing Color: Gold; Ingress Protection: -; Center Contact Plating: Gold; Operating Temperature: -65°C ~ 165°C; ComponentLink1URL: https://cinchconnectivity.com/OA_MEDIA/specs/pi-142-0701-231.pdf; ComponentLink1Description: https://cinchconnectivity.com/OA_MEDIA/specs/pi-142-0701-231.pdf; Stock: 9668; Stock 1: 9535; Pricing 1: 1=5.46, 10=4.861, 50=3.968, 100=3.5712, 250=3.2736, 500=2.7776, 750=2.63872, 1000=2.48, 2500=2.3808 (USD)
P11 P12 P15 = Header Male 3M-452 15x2: CONN HEADER SMD 30POS 1.27MM; Manufacturer: 3M; Current Rating: 1A; Voltage Rating: 125V; Number of Positions: 30; Connector Type: Male Pin; Row Spacing: 0.05inch; ComponentLink1Description: Supplier Link; ComponentLink1URL: https://www.digikey.com/products/en?keywords=3M15579CT-ND; ComponentLink2Description: Datasheet; ComponentLink2URL: https://media.digikey.com/pdf/Data%20Sheets/3M%20PDFs/451,452_Series_Header&Socket.pdf; Supplier 1: Digi-Key; Manufacturer Part Number: 45230-220230; Stock 1: 334; Pricing 1: 1 = 10.50000, 10 = 10.04800, 100 = 8.44930 (USD); RoHS: Yes; Mount: Surface Mount; Contact Plating: Gold; Contact Material: Copper Alloy,Bronze; Housing Material: Liquid Crystal Polymer; Min Operating Temperature: -55°C; Max Operating Temperature: 105°C; Number of Rows: 2; Contact Gender: Male; Package Quantity: 500; Fastening Type: Latch; Packaging: Cut Tape; Termination: Solder; Number of Contacts: 30; Pitch: 1.27mm; Flammability Rating: UL94 V-0; Supplier Part Number 1: 3M15579CT-ND
P13 P14 = 62100821021: WR-PHD Pin Header, SMT, pitch 1.27mm, Dual Row, Vertical, 8pin; Pin Number: 8; Gender: Male; Rated Current: 1A; Working Voltage: 100VAC; Withstanding Voltage: 500VAC; Contact Resistance: 20mOhm; ComponentLink1Description: Manufacturer; ComponentLink1URL: http://www.we-online.de; ComponentLink2Description: Datasheet; ComponentLink2URL: https://katalog.we-online.de/em/datasheet/62100821021.pdf; Part Number: 62100821021; Published Date: June 2019; Publisher: Wurth Elektronik; Pitch: 1.27mm; Operating Temperature: -40 to +105degC; Mounting Technology: SMT; Packaging: Tube; Row Number: Dual; Orientation: Vertical
P16 P17 = 62100421021: WR-PHD Pin Header, SMT, pitch 1.27mm, Dual Row, Vertical, 4pin; Pin Number: 4; Gender: Male; Rated Current: 1A; Working Voltage: 100VAC; Withstanding Voltage: 500VAC; Contact Resistance: 20mOhm; ComponentLink1Description: Manufacturer; ComponentLink1URL: http://www.we-online.de; ComponentLink2Description: Datasheet; ComponentLink2URL: https://katalog.we-online.de/em/datasheet/62100421021.pdf; Part Number: 62100421021; Published Date: June 2019; Publisher: Wurth Elektronik; Pitch: 1.27mm; Operating Temperature: -40 to +105degC; Mounting Technology: SMT; Packaging: Tube; Row Number: Dual; Orientation: Vertical
R39 R43 = R_49.9_1206_1%: RES 50 OHM 1/2W 1% 1206 SMD; Manufacturer: Panasonic; Manufacturer Part Number: ERJ8ENF49R9V; Temperature Coefficient: 100ppm/°C; Max Power Dissipation: 250mW; Voltage Rating (DC): 200V; Supplier 1: Digi-Key; Supplier Part Number 1: P49.9FCT-ND; RoHS: Yes; Packaging: Tape and Reel; Tolerance: 1%; Composition: Thick Film; Features: Automotive AEC-Q200; Height: 0.6mm; Number of Terminations: 2; ComponentLink1URL: http://www.vishay.com/docs/20043/crcwhpe3.pdf; ComponentLink1Description: http://www.vishay.com/docs/20043/crcwhpe3.pdf; Case/Package: 1206; Case Code (Imperial): 1206; Case Code (Metric): 3216; ComponentLink2Description: https://datasheet.ciiva.com/30178/aoa0000ce2-30178133.pdf?src-supplier=Onlinecomponents.com; ComponentLink2URL: https://datasheet.ciiva.com/30178/aoa0000ce2-30178133.pdf?src-supplier=Onlinecomponents.com; ComponentLink3Description: https://datasheet.ciiva.com/43460/426256-43460149.pdf?src-supplier=Farnell; ComponentLink3URL: https://datasheet.ciiva.com/43460/426256-43460149.pdf?src-supplier=Farnell; ComponentLink4Description: https://datasheet.ciiva.com/46377/426256-46377239.pdf?src-supplier=Element14; ComponentLink4URL: https://datasheet.ciiva.com/46377/426256-46377239.pdf?src-supplier=Element14; ComponentLink5Description: https://datasheet.ciiva.com/24027/aoa0000ce2-24027304.pdf?src-supplier=Mouser; ComponentLink5URL: https://datasheet.ciiva.com/24027/aoa0000ce2-24027304.pdf?src-supplier=Mouser; ComponentLink6Description: https://datasheet.ciiva.com/46388/426256-46388904.pdf?src-supplier=Element14; ComponentLink6URL: https://datasheet.ciiva.com/46388/426256-46388904.pdf?src-supplier=Element14; ComponentLink7Description: https://datasheet.ciiva.com/6159/426256-6159641.pdf?src-supplier=Farnell; ComponentLink7URL: https://datasheet.ciiva.com/6159/426256-6159641.pdf?src-supplier=Farnell; ComponentLink8Description: https://datasheet.ciiva.com/27055/1990245-27055770.pdf?src-supplier=Jameco; ComponentLink8URL: https://datasheet.ciiva.com/27055/1990245-27055770.pdf?src-supplier=Jameco; ComponentLink9Description: https://datasheet.ciiva.com/16725/70260748-16725115.pdf?src-supplier=Allied+Electronics; ComponentLink9URL: https://datasheet.ciiva.com/16725/70260748-16725115.pdf?src-supplier=Allied+Electronics; ComponentLink10Description: https://datasheet.ciiva.com/28694/1678782-28694252.pdf?src-supplier=Element14; ComponentLink10URL: https://datasheet.ciiva.com/28694/1678782-28694252.pdf?src-supplier=Element14; ComponentLink11Description: https://datasheet.ciiva.com/16785/70260748-16785263.pdf?src-supplier=Allied+Electronics; ComponentLink11URL: https://datasheet.ciiva.com/16785/70260748-16785263.pdf?src-supplier=Allied+Electronics; ComponentLink12Description: https://datasheet.ciiva.com/17209/aoa0000ce2-17209487.pdf?src-supplier=Avnet+Europe; ComponentLink12URL: https://datasheet.ciiva.com/17209/aoa0000ce2-17209487.pdf?src-supplier=Avnet+Europe; Contact Plating: Tin; Depth: 1.6mm; Lead Free: Lead Free; Length: 3.2mm; Max Operating Temperature: 155°C; Military Standard: Not; Min Operating Temperature: -55°C; Mount: Surface Mount; Package Quantity: 1; Power Rating: 250mW; Pricing 1: 1 = 0.11000, 10 = 0.10000, 100 = 0.03850, 1000 = 0.01695, 2500 = 0.01464 (USD); Radiation Hardening: No; REACH SVHC: Unknown; Stock 1: 167353; Termination: SMD/SMT; Voltage Rating: 200V; Width: 0.063inch; Working Voltage: 200V
R40-R42 R44-R72 = R_28.0_603_1%: RES 28.0 OHM 1/10W 1% 0603 SMD; Manufacturer: Panasonic; Manufacturer Part Number: ERJ3EKF28R0V; Power Rating: 100mW; Voltage Rating: 75V; Temperature Coefficient: 100ppm/°C; Voltage Rating (DC): 50V; Supplier 1: Digi-Key; Stock 1: 75130; Pricing 1: 1 = 0.10000, 10 = 0.06500, 100 = 0.02640, 1000 = 0.01186, 2500 = 0.01029 (USD); RoHS: Yes; Mount: Surface Mount; Case/Package: 0603; Case Code (Imperial): 0603; Case Code (Metric): 1608; Contact Plating: Tin; Min Operating Temperature: -55°C; Max Operating Temperature: 155°C; Tolerance: 1%; Package Quantity: 1; Packaging: Tape and Reel; Composition: Thick Film; Number of Terminations: 2; Max Power Dissipation: 100mW; Features: Automotive AEC-Q200; Length: 1.6mm; Height: 0.022inch; Width: 0.8mm; Radiation Hardening: No; REACH SVHC: Yes; Lead Free: Lead Free; ComponentLink1URL: https://datasheet.ciiva.com/46437/1678782-46437594.pdf?src-supplier=Element14; ComponentLink1Description: https://datasheet.ciiva.com/46437/1678782-46437594.pdf?src-supplier=Element14; ComponentLink2URL: https://datasheet.ciiva.com/22676/1678782-22676667.pdf?src-supplier=Element14; ComponentLink2Description: https://datasheet.ciiva.com/22676/1678782-22676667.pdf?src-supplier=Element14; ComponentLink3URL: https://datasheet.ciiva.com/22736/1678782-22736555.pdf?src-supplier=Element14; ComponentLink3Description: https://datasheet.ciiva.com/22736/1678782-22736555.pdf?src-supplier=Element14; Supplier Part Number 1: P28.0HCT-ND
R73-R80 = R_49.9_603_1%: RES 49.9 OHM 1/10W 1% 0603 SMD; Manufacturer: Panasonic; Manufacturer Part Number: ERJ3EKF49R9V; Temperature Coefficient: 100ppm/°C; Power Rating: 100mW; Voltage Rating: 75V; Voltage Rating (DC): 50V; Working Voltage: 6V; Supplier 1: Digi-Key; Stock 1: 2435501; Pricing 1: 1 = 0.100000, 10 = 0.065000, 100 = 0.026400, 1000 = 0.011860, 2500 = 0.010290 (USD); RoHS: Yes; Mount: Surface Mount; Case/Package: 0603; Contact Plating: Tin; Case Code (Imperial): 0603; Case Code (Metric): 1608; Min Operating Temperature: -55°C; Max Operating Temperature: 155°C; Tolerance: 1%; Composition: Thick Film; Packaging: Tape and Reel; Package Quantity: 1; Number of Terminations: 2; Military Standard: Not; Termination: SMD/SMT; Max Power Dissipation: 100mW; Features: Automotive AEC-Q200; Length: 1.6mm; Height: 0.022inch; Width: 0.8mm; Depth: 0.8mm; Radiation Hardening: No; REACH SVHC: Unknown; Lead Free: Lead Free; ComponentLink1URL: https://datasheet.ciiva.com/16766/70260748-16766262.pdf?src-supplier=Allied+Electronics; ComponentLink1Description: https://datasheet.ciiva.com/16766/70260748-16766262.pdf?src-supplier=Allied+Electronics; ComponentLink2URL: https://datasheet.ciiva.com/9117/aoa0000ce2-9117128.pdf?src-supplier=Avnet; ComponentLink2Description: https://datasheet.ciiva.com/9117/aoa0000ce2-9117128.pdf?src-supplier=Avnet; ComponentLink3URL: https://datasheet.ciiva.com/16772/70260748-16772570.pdf?src-supplier=Allied+Electronics; ComponentLink3Description: https://datasheet.ciiva.com/16772/70260748-16772570.pdf?src-supplier=Allied+Electronics; ComponentLink4URL: https://datasheet.ciiva.com/28694/1678782-28694219.pdf?src-supplier=Element14; ComponentLink4Description: https://datasheet.ciiva.com/28694/1678782-28694219.pdf?src-supplier=Element14; ComponentLink5URL: https://datasheet.ciiva.com/30095/aoa0000ce2-30095355.pdf?src-supplier=Onlinecomponents.com; ComponentLink5Description: https://datasheet.ciiva.com/30095/aoa0000ce2-30095355.pdf?src-supplier=Onlinecomponents.com; ComponentLink6URL: https://datasheet.ciiva.com/48531/aoa0000ce2-48531019.pdf?src-supplier=Avnet; ComponentLink6Description: https://datasheet.ciiva.com/48531/aoa0000ce2-48531019.pdf?src-supplier=Avnet; ComponentLink7URL: https://datasheet.ciiva.com/46388/1678782-46388908.pdf?src-supplier=Element14; ComponentLink7Description: https://datasheet.ciiva.com/46388/1678782-46388908.pdf?src-supplier=Element14; Supplier Part Number 1: P49.9HCT-ND
TP3-TP5 = Test Point SM: 5019KCT-ND; Manufacturer: Keystone Electronics; Manufacturer Part Number: 5019; Supplier 1: Digi-Key; Supplier Part Number 1: 5019KCT-ND; RoHS: RoHS Compliant; Category: Test and Measurement; Stock: 10485; Pricing: 1=0.3, 10=0.287, 50=0.2092, 100=0.201, 250=0.18048, 500=0.17228 (USD); Packaging: Cut Tape (CT); Type: PC Test Point, Miniature; Terminal: 0.015" (0.38mm) Phosphor Bronze, Silver Plated; Mounting Type: Surface Mount; Material: Phosphor Bronze; Color: -; ComponentLink1URL: http://www.keyelco.com/product-pdf.cfm?p=1357; ComponentLink1Description: http://www.keyelco.com/product-pdf.cfm?p=1357
U13 U15 U16 = DS90LV012ATMF: 3V LVDS Single CMOS Differential Line Receiver, 5-pin SOT-23; Manufacturer: TI National Semiconductor; Manufacturer Part Number: DS90LV012ATMF/NOPB; Number of Elements: 1; Propagation Delay: 3.5ns; Operating Supply Voltage: 3.3V; Max Supply Voltage: 3.6V; Min Supply Voltage: 2.7V; Max Power Dissipation: 2.26W; Data Rate: 400Mbps; Max Supply Current: 9mA; Power Consumption: 18W; ComponentLink1URL: http://www.ti.com/lit/ds/symlink/ds90lv012a.pdf; ComponentLink1Description: http://www.ti.com/lit/ds/symlink/ds90lv012a.pdf; ComponentLink2URL: https://datasheet.ciiva.com/15133/getdatasheetpartid-627853-15133191.pdf?src-supplier=Verical; ComponentLink2Description: https://datasheet.ciiva.com/15133/getdatasheetpartid-627853-15133191.pdf?src-supplier=Verical; ComponentLink3URL: https://datasheet.ciiva.com/41460/001187784-da-01-en-ic-line-ds90lv012atmf-nopb-sot-23-5-tid-41460741.pdf?src-supplier=Conrad; ComponentLink3Description: https://datasheet.ciiva.com/41460/001187784-da-01-en-ic-line-ds90lv012atmf-nopb-sot-23-5-tid-41460741.pdf?src-supplier=Conrad; ComponentLink4URL: https://datasheet.ciiva.com/1709/ds90lt012a-1709907.pdf?src-supplier=Digi-Key; ComponentLink4Description: https://datasheet.ciiva.com/1709/ds90lt012a-1709907.pdf?src-supplier=Digi-Key; ComponentLink5URL: https://datasheet.ciiva.com/3151/ds90lv012a-3151479.pdf?src-supplier=Avnet; ComponentLink5Description: https://datasheet.ciiva.com/3151/ds90lv012a-3151479.pdf?src-supplier=Avnet; ComponentLink6URL: https://datasheet.ciiva.com/1554/1849915-1554728.pdf?src-supplier=Farnell; ComponentLink6Description: https://datasheet.ciiva.com/1554/1849915-1554728.pdf?src-supplier=Farnell; ComponentLink7URL: https://datasheet.ciiva.com/3151/ds90lv012a-3151480.pdf?src-supplier=Avnet; ComponentLink7Description: https://datasheet.ciiva.com/3151/ds90lv012a-3151480.pdf?src-supplier=Avnet; ComponentLink8URL: https://datasheet.ciiva.com/1709/ds90lt012a-1709945.pdf?src-supplier=Digi-Key; ComponentLink8Description: https://datasheet.ciiva.com/1709/ds90lt012a-1709945.pdf?src-supplier=Digi-Key; ComponentLink9URL: https://datasheet.ciiva.com/1709/ds90lt012a-1709946.pdf?src-supplier=Digi-Key; ComponentLink9Description: https://datasheet.ciiva.com/1709/ds90lt012a-1709946.pdf?src-supplier=Digi-Key; Supplier 1: Digi-Key; Stock 1: 46821; Pricing 1: 1=1.05000, 10=0.93600, 100=0.72970, 500=0.60276 (USD); RoHS: Yes; Mount: Surface Mount; Case/Package: SOT-23; Number of Pins: 5; Min Operating Temperature: -40°C; Max Operating Temperature: 85°C; Packaging: Tape and Reel; Number of Receivers: 1; Number of Drivers: 1; Turn-On Delay Time: 3.5ns; Power Dissipation: 2.26W; Number of Channels: 1; Package Quantity: 1000; Length: 2.92mm; Height: 1.02mm; Width: 1.6mm; Radiation Hardening: No; REACH SVHC: No SVHC; Lead Free: Lead Free; Supplier Part Number 1: DS90LV012ATMF/NOPBCT-ND
U14 = DS90LV011ATMF: Single High Speed Differential Driver, 5-pin SOT-23; Manufacturer: Texas Instruments; Manufacturer Part Number: DS90LV011ATMF/NOPB; Data Rate: 400Mbps; Nominal Supply Current: 7mA; Min Supply Voltage: 3V; Max Supply Voltage: 3.6V; Max Power Dissipation: 902mW; Number of Receivers: 1; Propagation Delay: 1.5ns; Operating Supply Voltage: 3.3V; Max Supply Current: 10mA; Power Consumption: 17W; Max Output Current: -24mA; Interface: LVDS; Max Output Voltage: 450mV; Supplier 1: Digi-Key; Supplier Part Number 1: DS90LV011ATMF/NOPBCT-ND; RoHS: Yes; Packaging: Tape and Reel; ComponentLink1URL: http://www.ti.com/lit/ds/symlink/ds90lv011a.pdf; ComponentLink1Description: http://www.ti.com/lit/ds/symlink/ds90lv011a.pdf; Stock 1: 57010; Pricing 1: 1 = 1.26000, 10 = 1.12400, 100 = 0.87650, 500 = 0.72410 (USD); Mount: Surface Mount; Case/Package: SOT-23; Number of Pins: 5; Weight: 0.00709oz; Min Operating Temperature: -40°C; Max Operating Temperature: 85°C; Package Quantity: 1000; Number of Elements: 1; Number of Drivers: 1; Turn-On Delay Time: 1.5ns; Power Dissipation: 902mW; Number of Channels: 1; Operating Supply Current: 10mA; Termination: SMD/SMT; Length: 2.92mm; Height: 1.02mm; Width: 1.6mm; Radiation Hardening: No; REACH SVHC: No SVHC; Lead Free: Lead Free; ComponentLink2URL: https://datasheet.ciiva.com/46381/1581201-46381879.pdf?src-supplier=Element14; ComponentLink2Description: https://datasheet.ciiva.com/46381/1581201-46381879.pdf?src-supplier=Element14; ComponentLink3URL: https://datasheet.ciiva.com/46381/1882279-46381880.pdf?src-supplier=Element14; ComponentLink3Description: https://datasheet.ciiva.com/46381/1882279-46381880.pdf?src-supplier=Element14
U17 = SN74LVC2T45QDCURQ1: Voltage Level Translator Bidirectional 1 Circuit 2 Channel 420Mbps SM8 (SSOP); Generic Part Number: SN74LVC2T45-Q1; Manufacturer: Texas Instruments; Manufacturer Part Number: SN74LVC2T45MDCTTEP; VCC(Min)(V): 1.65; VCC(Max)(V): 5.5; Output Type: CMOS; Logic: True; ICC @ Nom Voltage(Max)(mA): 0.004; Input Type: CMOS/TTL; Bits(#): 2; F @ Nom Voltage(Max)(Mhz): 150; Rating: Automotive; Technology Family: LVC; Voltage(Nom)(V): 1.8,2.5,3.3,5; Schmitt Trigger: No; Output Drive (IOL/IOH)(Max)(mA): 32/-32; Sub-Family: Dual Supply Translator; 3-State Output: Yes; tpd @ Nom Voltage(Max)(ns): 19.5,12,9.6,8.4; Max Supply Voltage: 5.5V; Min Supply Voltage: 1.65V; Propagation Delay: 3.5ns; Output Current: 32mA; Number of Elements: 1; Turn-On Delay Time: 53.2ns; Polarity: Non-Inverting; High Level Output Current: -32mA; Quiescent Current: 12mA; DatasheetVersion: SCES818; PackageReference: DCU0008A; Operating Temperature Range(C): -40 to 125; PartNumber: SN74LVC2T45QDCURQ1; ComponentLink1Description: Manufacturer URL; ComponentLink1URL: http://www.ti.com/; ComponentLink2Description: Datasheet; ComponentLink2URL: http://www.ti.com/lit/ds/symlink/sn74lvc2t45-q1.pdf; Supplier 1: Digi-Key; Stock 1: 5778; Pricing 1: 1 = 1.67000, 10 = 1.50100, 100 = 1.20660 (USD); RoHS: Yes; Mount: Surface Mount; Case/Package: SSOP; Number of Pins: 8; Weight: 0.000825oz; Contact Plating: Gold; Min Operating Temperature: -55°C; Max Operating Temperature: 125°C; Packaging: Tape and Reel; Package Quantity: 250; Number of Channels: 2; Data Rate: 420Mbps; Number of Inputs: 2; Direction: Bidirectional; Logic Function: Translator; Number of Bits: 2; Low Level Output Current: 32mA; Radiation Hardening: No; REACH SVHC: No SVHC; Lead Free: Lead Free; ComponentLink3URL: https://datasheet.ciiva.com/14316/sn74lvc2t45-ep-14316386.pdf?src-supplier=Avnet; ComponentLink3Description: https://datasheet.ciiva.com/14316/sn74lvc2t45-ep-14316386.pdf?src-supplier=Avnet; ComponentLink4URL: https://datasheet.ciiva.com/15086/getdatasheetpartid-144548-15086248.pdf?src-supplier=Verical; ComponentLink4Description: https://datasheet.ciiva.com/15086/getdatasheetpartid-144548-15086248.pdf?src-supplier=Verical; ComponentLink5URL: https://datasheet.ciiva.com/1899/sn74lvc2t45-ep-1899619.pdf?src-supplier=Digi-Key; ComponentLink5Description: https://datasheet.ciiva.com/1899/sn74lvc2t45-ep-1899619.pdf?src-supplier=Digi-Key; ComponentLink6URL: https://datasheet.ciiva.com/1899/sn74lvc2t45-ep-1899620.pdf?src-supplier=Digi-Key; ComponentLink6Description: https://datasheet.ciiva.com/1899/sn74lvc2t45-ep-1899620.pdf?src-supplier=Digi-Key; ComponentLink7URL: https://datasheet.ciiva.com/1899/sn74lvc2t45-ep-1899621.pdf?src-supplier=Digi-Key; ComponentLink7Description: https://datasheet.ciiva.com/1899/sn74lvc2t45-ep-1899621.pdf?src-supplier=Digi-Key; ComponentLink8URL: https://datasheet.ciiva.com/48701/001073867-da-01-en-ic-bus-trans-sn74lvc2t45mdcttep-sm-8-tid-48701957.pdf?src-supplier=Conrad; ComponentLink8Description: https://datasheet.ciiva.com/48701/001073867-da-01-en-ic-bus-trans-sn74lvc2t45mdcttep-sm-8-tid-48701957.pdf?src-supplier=Conrad; Supplier Part Number 1: 296-23952-1-ND

## Sheet Revisions.SchDoc
size B; DrawnBy: PWS; Engineer: PWS; DocumentNumber: 1; Revision: 1; SheetNumber: 1; SheetTotal: 7
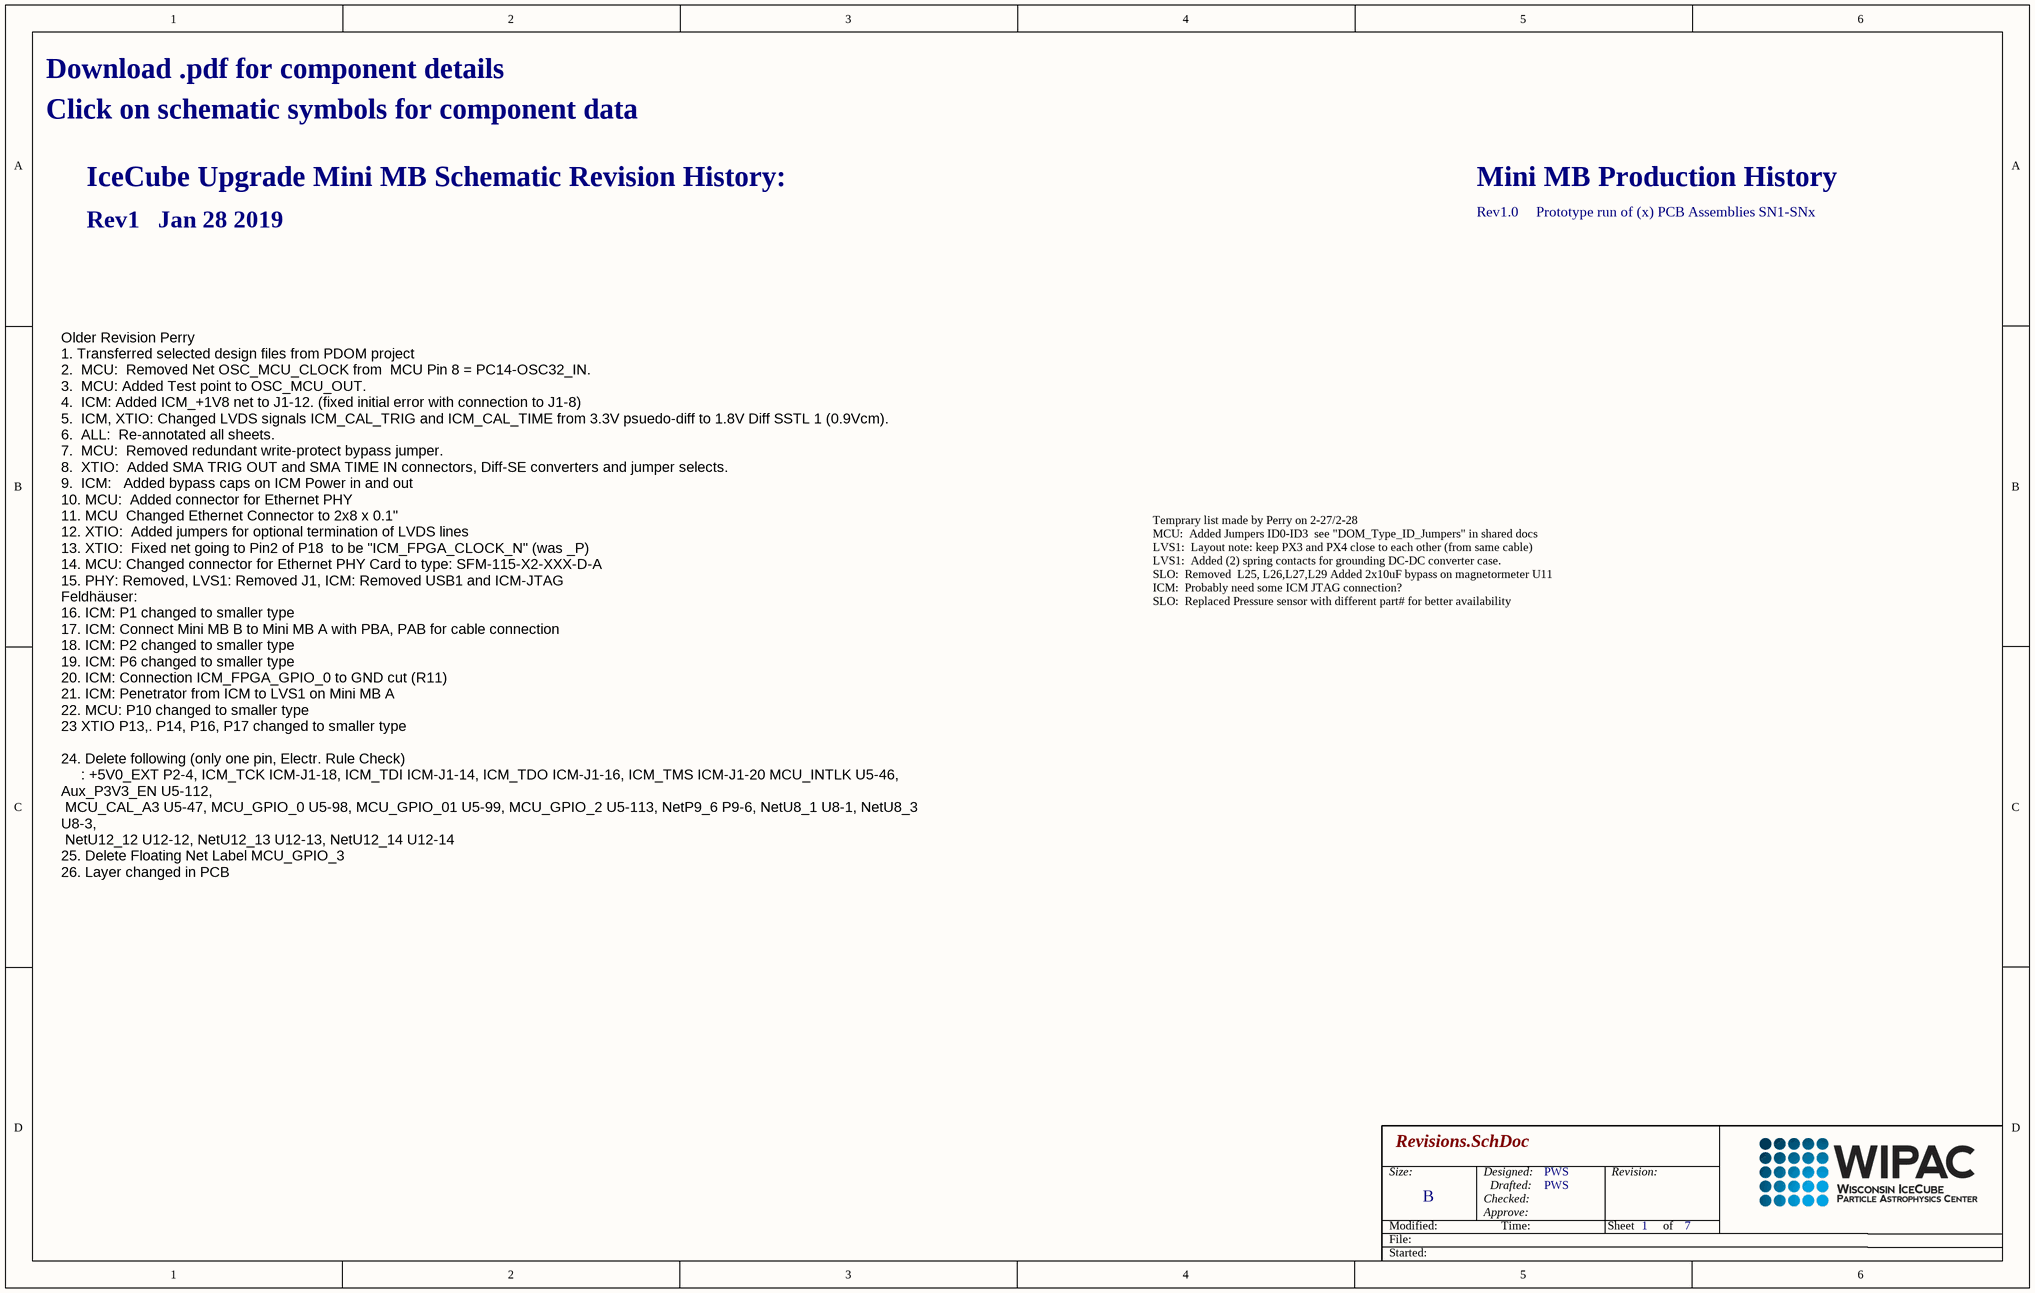
[diagram p5: Revisions.SchDoc]

### Notes on the sheet
- Download .pdf for component details
- Click on schematic symbols for component data
- IceCube Upgrade Mini MB Schematic Revision History:
- Rev1   Jan 28 2019
- Rev1.0     Prototype run of (x) PCB Assemblies SN1-SNx
- Mini MB Production History
- Temprary list made by Perry on 2-27/2-28
  MCU:  Added Jumpers ID0-ID3  see "DOM_Type_ID_Jumpers" in shared docs
  LVS1:  Layout note: keep PX3 and PX4 close to each other (from same cable)
  LVS1:  Added (2) spring contacts for grounding DC-DC converter case.
  SLO:  Removed  L25, L26,L27,L29 Added 2x10uF bypass on magnetormeter U11
  ICM:  Probably need some ICM JTAG connection?
  SLO:  Replaced Pressure sensor with different part# for better availability
- Older Revision Perry
  1. Transferred selected design files from PDOM project
  2.  MCU:  Removed Net OSC_MCU_CLOCK from  MCU Pin 8 = PC14-OSC32_IN.
  3.  MCU: Added Test point to OSC_MCU_OUT.
  4.  ICM: Added ICM_+1V8 net to J1-12. (fixed initial error with connection to J1-8)
  5.  ICM, XTIO: Changed LVDS signals ICM_CAL_TRIG and ICM_CAL_TIME from 3.3V psuedo-diff to 1.8V Diff SSTL 1 (0.9Vcm).
  6.  ALL:  Re-annotated all sheets.
  7.  MCU:  Removed redundant write-protect bypass jumper.
  8.  XTIO:  Added SMA TRIG OUT and SMA TIME IN connectors, Diff-SE converters and jumper selects.
  9.  ICM:   Added bypass caps on ICM Power in and out
  10. MCU:  Added connector for Ethernet PHY
  11. MCU  Changed Ethernet Connector to 2x8 x 0.1"
  12. XTIO:  Added jumpers for optional termination of LVDS lines
  13. XTIO:  Fixed net going to Pin2 of P18  to be "ICM_FPGA_CLOCK_N" (was _P)
  14. MCU: Changed connector for Ethernet PHY Card to type: SFM-115-X2-XXX-D-A
  15. PHY: Removed, LVS1: Removed J1, ICM: Removed USB1 and ICM-JTAG
  Feldhäuser:
  16. ICM: P1 changed to smaller type
  17. ICM: Connect Mini MB B to Mini MB A with PBA, PAB for cable connection
  18. ICM: P2 changed to smaller type
  19. ICM: P6 changed to smaller type
  20. ICM: Connection ICM_FPGA_GPIO_0 to GND cut (R11)
  21. ICM: Penetrator from ICM to LVS1 on Mini MB A
  22. MCU: P10 changed to smaller type
  23 XTIO P13,. P14, P16, P17 changed to smaller type
  24. Delete following (only one pin, Electr. Rule Check)
  : +5V0_EXT P2-4, ICM_TCK ICM-J1-18, ICM_TDI ICM-J1-14, ICM_TDO ICM-J1-16, ICM_TMS ICM-J1-20 MCU_INTLK U5-46, Aux_P3V3_EN U5-112,
  MCU_CAL_A3 U5-47, MCU_GPIO_0 U5-98, MCU_GPIO_01 U5-99, MCU_GPIO_2 U5-113, NetP9_6 P9-6, NetU8_1 U8-1, NetU8_3 U8-3,
  NetU12_12 U12-12, NetU12_13 U12-13, NetU12_14 U12-14
  25. Delete Floating Net Label MCU_GPIO_3
  26. Layer changed in PCB
- Size:
- Designed:
- Revision:
- Modified:
- File:
- B
- Checked:
- Approve:
- Drafted:
- Time:
- Sheet
- of
- Started: